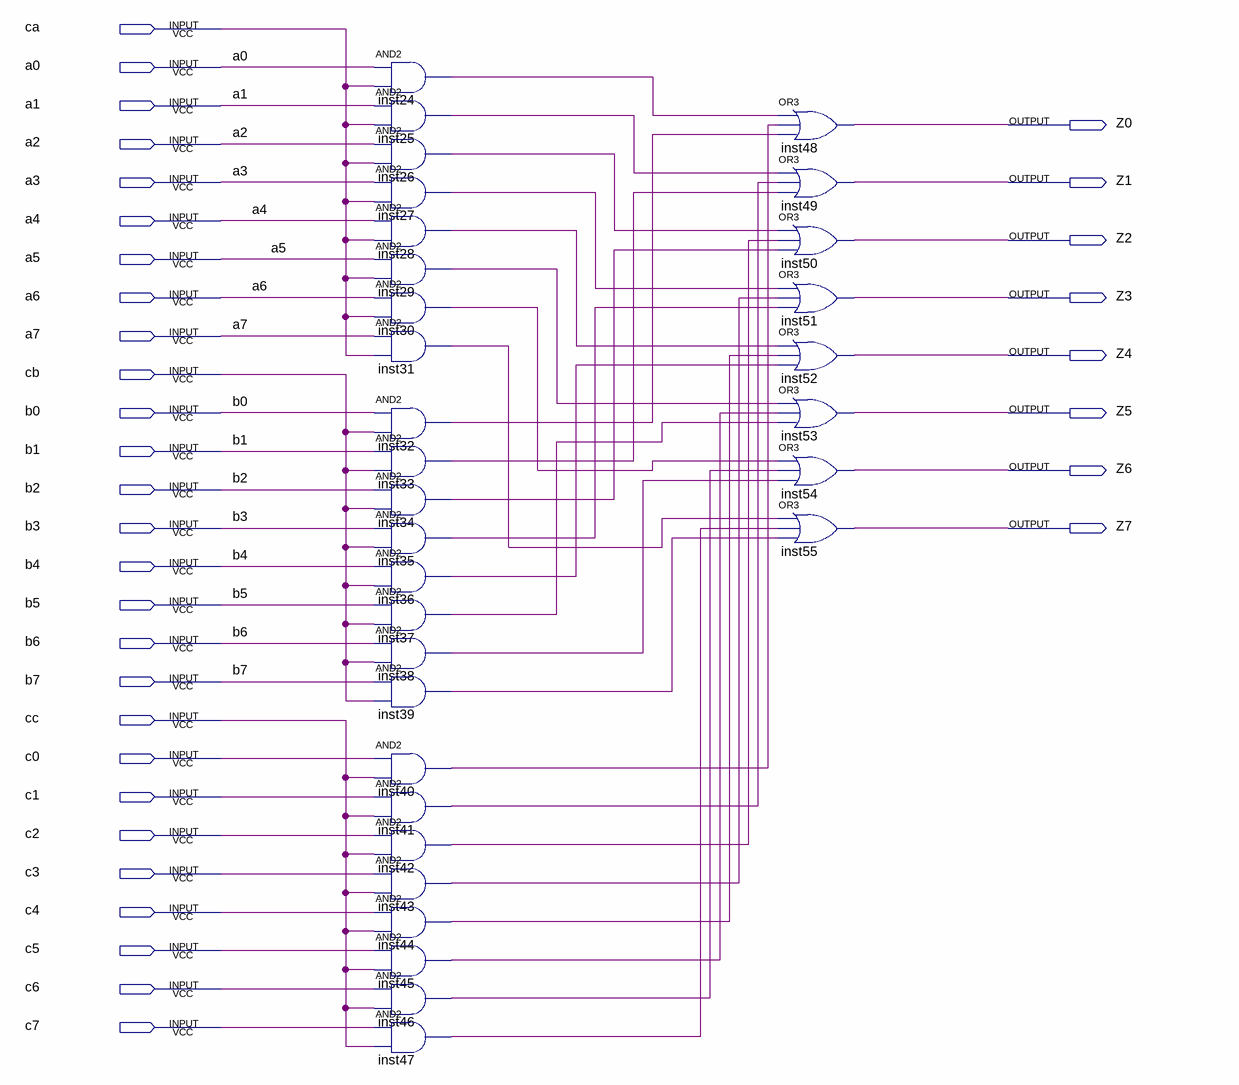
[diagram p0: schematic sheet]
// Quartus schematic MUX.bdf as structural Verilog: 32 symbols, 35 pins
module MUX (
  input  ca,
  input  a0,
  input  a1,
  input  a2,
  input  a3,
  input  a4,
  input  a5,
  input  a6,
  input  a7,
  input  cb,
  input  b0,
  input  b1,
  input  b2,
  input  b3,
  input  b4,
  input  b5,
  input  b6,
  input  b7,
  input  cc,
  input  c0,
  input  c1,
  input  c2,
  input  c3,
  input  c4,
  input  c5,
  input  c6,
  input  c7,
  output Z0,
  output Z1,
  output Z2,
  output Z3,
  output Z4,
  output Z5,
  output Z6,
  output Z7
);

  wire inst24_out, inst25_out, inst26_out, inst27_out, inst28_out, inst29_out, inst30_out, inst31_out,
       inst32_out, inst33_out, inst34_out, inst35_out, inst36_out, inst37_out, inst38_out, inst39_out,
       inst40_out, inst41_out, inst42_out, inst43_out, inst44_out, inst45_out, inst46_out, inst47_out;

  and inst24 (inst24_out, a0, ca);
  and inst25 (inst25_out, a1, ca);
  and inst26 (inst26_out, a2, ca);
  and inst27 (inst27_out, a3, ca);
  and inst28 (inst28_out, a4, ca);
  and inst29 (inst29_out, a5, ca);
  and inst30 (inst30_out, a6, ca);
  and inst31 (inst31_out, a7, ca);
  and inst32 (inst32_out, b0, cb);
  and inst33 (inst33_out, b1, cb);
  and inst34 (inst34_out, b2, cb);
  and inst35 (inst35_out, b3, cb);
  and inst36 (inst36_out, b4, cb);
  and inst37 (inst37_out, b5, cb);
  and inst38 (inst38_out, b6, cb);
  and inst39 (inst39_out, b7, cb);
  and inst40 (inst40_out, c0, cc);
  and inst41 (inst41_out, c1, cc);
  and inst42 (inst42_out, c2, cc);
  and inst43 (inst43_out, c3, cc);
  and inst44 (inst44_out, c4, cc);
  and inst45 (inst45_out, c5, cc);
  and inst46 (inst46_out, c6, cc);
  and inst47 (inst47_out, c7, cc);
  or inst48 (Z0, inst24_out, inst40_out, inst32_out);
  or inst49 (Z1, inst25_out, inst41_out, inst33_out);
  or inst50 (Z2, inst26_out, inst42_out, inst34_out);
  or inst51 (Z3, inst27_out, inst43_out, inst35_out);
  or inst52 (Z4, inst28_out, inst44_out, inst36_out);
  or inst53 (Z5, inst29_out, inst45_out, inst37_out);
  or inst54 (Z6, inst30_out, inst46_out, inst38_out);
  or inst55 (Z7, inst31_out, inst47_out, inst39_out);
endmodule
